# EAGLE design receiver (EAGLE 7.7.0)
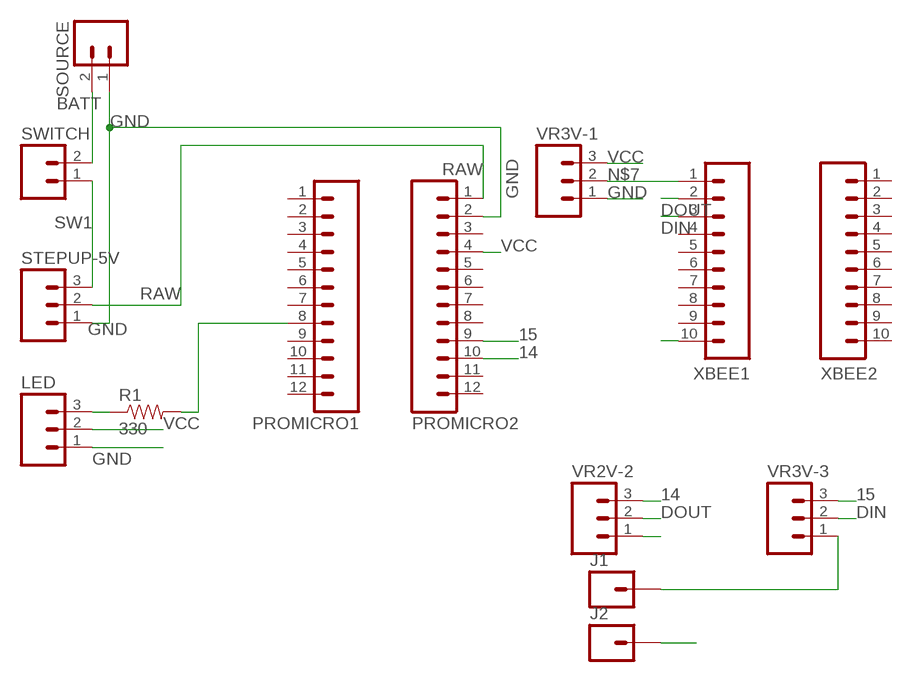
[diagram p0: schematic, sheet 1]

## Parts
J1  M01PTH  [1X01]
J2  M01PTH  [1X01]
LED  M03LOCK  [1X03_LOCK]
PROMICRO1  M12LOCK  [1X12_LOCK]
PROMICRO2  M12LOCK  [1X12_LOCK]
R1  330  RESISTORPTH-1/4W  [AXIAL-0.4]
SOURCE  M02JST-PTH-VERT  [JST-2-PTH-VERT]
STEPUP-5V  M03LOCK  [1X03_LOCK]
SWITCH  M02LOCK  [1X02_LOCK]
VR2V-2  M03LOCK  [1X03_LOCK]
VR3V-1  M03LOCK  [1X03_LOCK]
VR3V-3  M03LOCK  [1X03_LOCK]
XBEE1  M10LOCK  [1X10_LOCK]
XBEE2  M10LOCK  [1X10_LOCK]

## Nets
14: PROMICRO2.10 VR2V-2.3
15: PROMICRO2.9 VR3V-3.3
BATT: SOURCE.2 SWITCH.2
DIN: VR3V-3.2 XBEE1.3
DOUT: VR2V-2.2 XBEE1.2
GND: J1.1 J2.1 LED.1 PROMICRO2.2 SOURCE.1 STEPUP-5V.1 VR2V-2.1 VR3V-1.1 VR3V-3.1
N$1: LED.3 R1.P$1
N$2: PROMICRO1.8 R1.P$2
N$3: XBEE1.10
N$7: VR3V-1.2 XBEE1.1
RAW: PROMICRO2.1 STEPUP-5V.2
SW1: STEPUP-5V.3 SWITCH.1
VCC: LED.2 PROMICRO2.4 VR3V-1.3
Unconnected: PROMICRO1.1 PROMICRO1.2 PROMICRO1.3 PROMICRO1.4 PROMICRO1.5 PROMICRO1.6 PROMICRO1.7 PROMICRO1.9 PROMICRO1.10 PROMICRO1.11 PROMICRO1.12 PROMICRO2.3 PROMICRO2.5 PROMICRO2.6 PROMICRO2.7 PROMICRO2.8 PROMICRO2.11 PROMICRO2.12 XBEE1.4 XBEE1.5 XBEE1.6 XBEE1.7 XBEE1.8 XBEE1.9 XBEE2.1 XBEE2.2 XBEE2.3 XBEE2.4 XBEE2.5 XBEE2.6 XBEE2.7 XBEE2.8 XBEE2.9 XBEE2.10

## Library data of the parts
J1 J2 = SparkFun-Connectors:M01: Header 1 Standard 1-pin 0.1" header. Use with straight break away headers (SKU : PRT-00116), right angle break away headers (PRT-00553), swiss pins (PRT-00743), machine pins (PRT-00117), and female headers (PRT-00115). SMTSO-256-ET is a "flush mount" nut for a 4-40 screw. The older package used to be too tight, and did not allow it to sit properly thru the drill hit. The latest (0.165DIA) fits nice and snug.
LED STEPUP-5V VR2V-2 VR3V-1 VR3V-3 = SparkFun-Connectors:M03: Header 3 Standard 3-pin 0.1" header. Use with straight break away headers (SKU : PRT-00116), right angle break away headers (PRT-00553), swiss pins (PRT-00743), machine pins (PRT-00117), and female headers (PRT-00115). Molex polarized connector foot print use with SKU : PRT-08232 with associated crimp pins and housings.
PROMICRO1 PROMICRO2 = SparkFun-Connectors:M12: Header 12 Standard 12-pin 0.1" header. Use with straight break away headers (SKU : PRT-00116), right angle break away headers (PRT-00553), swiss pins (PRT-00743), machine pins (PRT-00117), and female headers (PRT-00115).
R1 = SparkFun-Passives:RESISTOR: Resistor Basic schematic elements and footprints for 0603, 1206, and PTH resistors.
SOURCE SWITCH = SparkFun-Connectors:M02: Standard 2-pin 0.1" header. Use with - straight break away headers ( PRT-00116) - right angle break away headers (PRT-00553) - swiss pins (PRT-00743) - machine pins (PRT-00117) - female headers (PRT-00115) Molex polarized connector foot print use with: PRT-08233 with associated crimp pins and housings. 2.54_SCREWTERM for use with PRT-10571. 3.5mm Screw Terminal footprints for PRT-08084 5mm Screw Terminal footprints for use with PRT-08432
XBEE1 XBEE2 = SparkFun-Connectors:M10: Header 10 Standard 10-pin 0.1" header. Use with straight break away headers (SKU : PRT-00116), right angle break away headers (PRT-00553), swiss pins (PRT-00743), machine pins (PRT-00117), and female headers (PRT-00115).

## Board
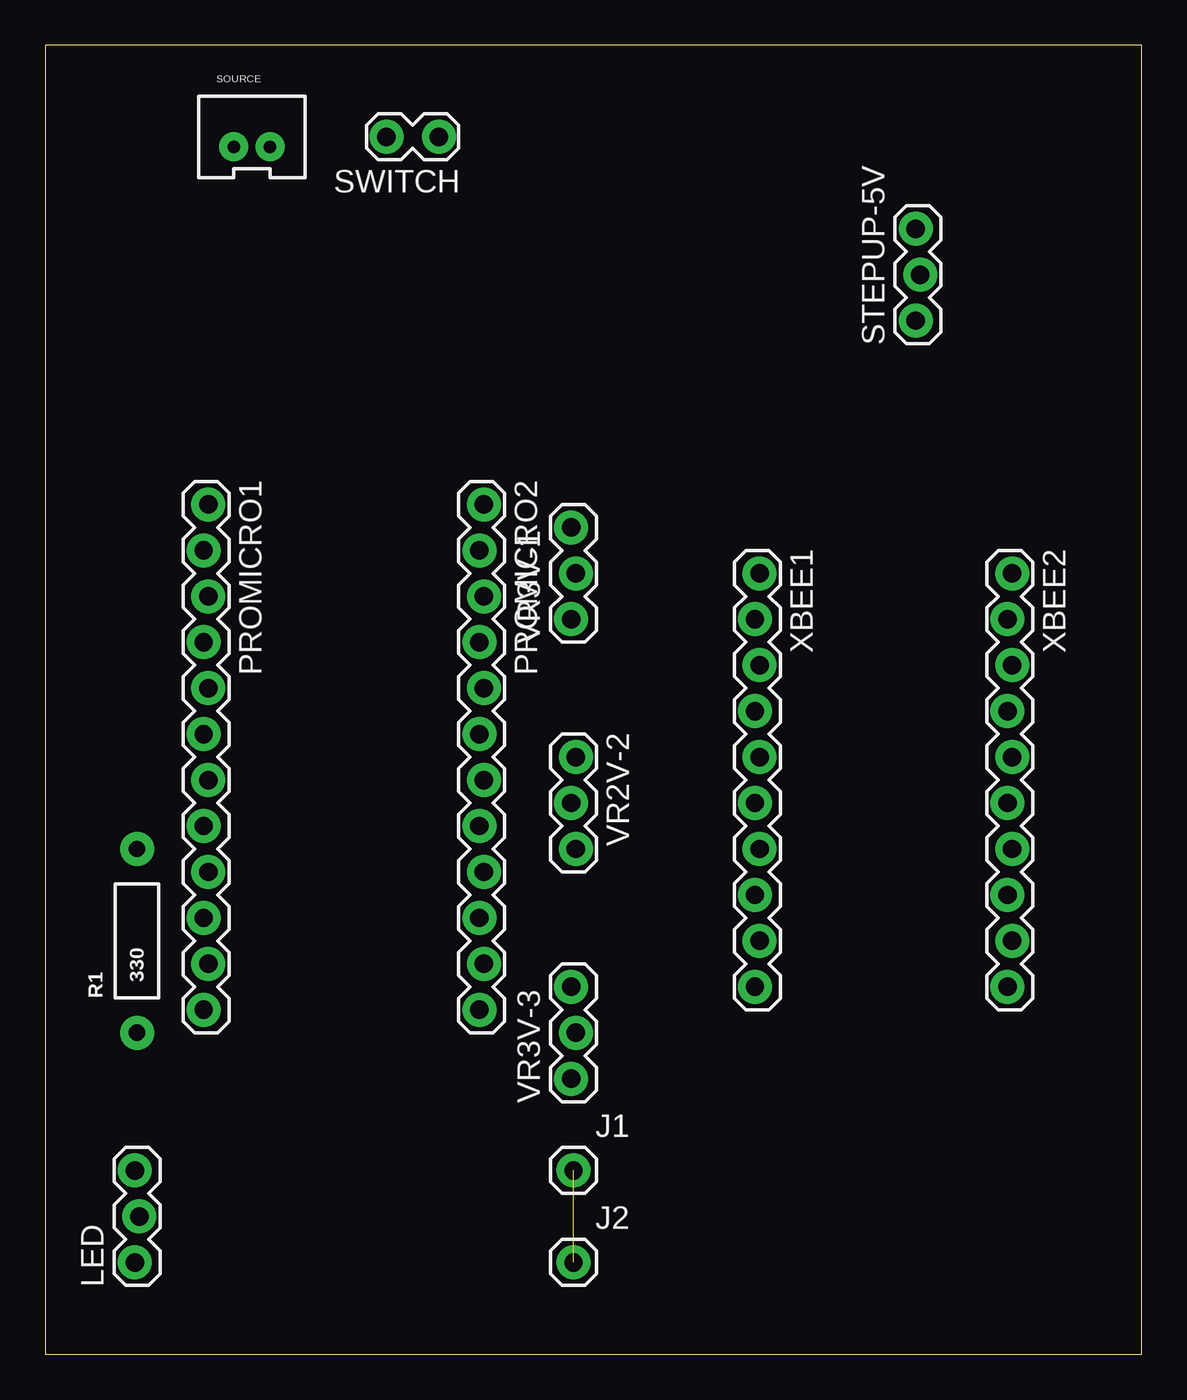
[diagram p1: board, top side]
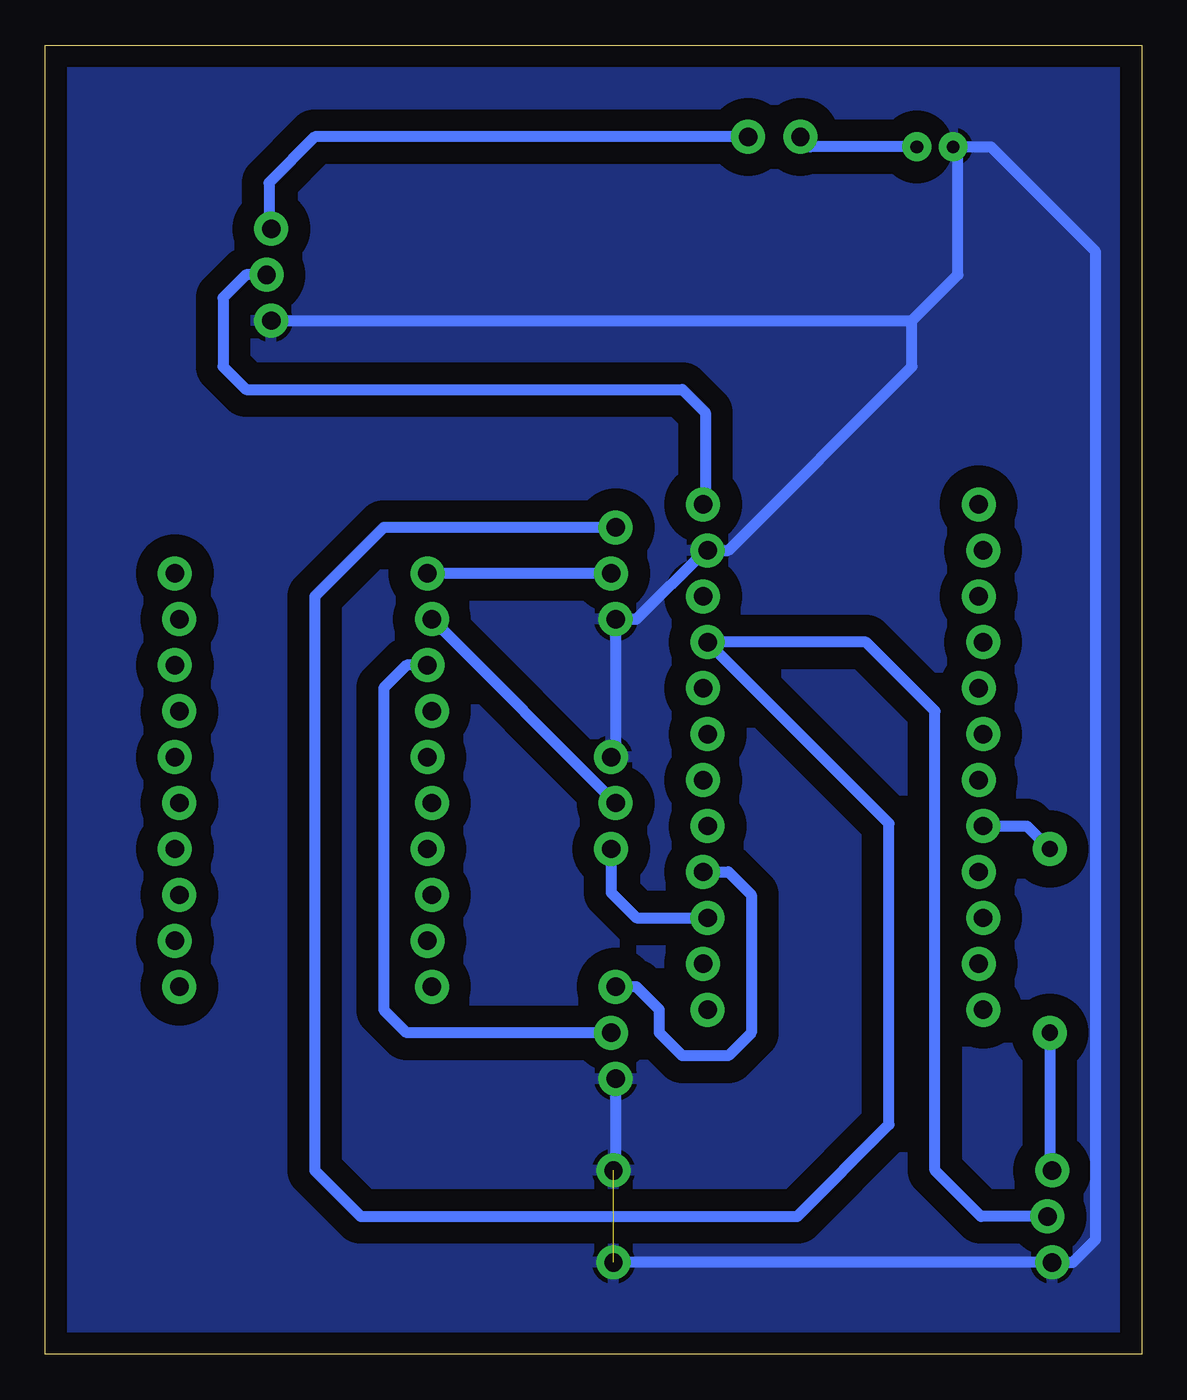
[diagram p2: board, bottom side, seen from below]

Size 60.63 x 72.38 mm. Coordinates in mm from the lower left corner, seen from the top.
Outline: 0,0 60.63,0 60.63,72.38 0,72.38 0,0
Copper layers (1*16): Top 0.035mm / dielectric 1.5mm / Bottom 0.035mm
Design rules "default": minimum track width 10mil, minimum drill 24mil, track to track 8mil, track to pad 8mil, pad to pad 8mil, via to via 8mil, smd to smd 8mil, copper to edge 40mil, drill to drill 8mil, minimum pad ring 10mil, minimum via ring 8mil, stop-mask expansion 4mil, vias tented up to drill 0mil, thermal gap 10mil

### Footprints (pad centres in the part's own frame; a part is rotated, then mirrored left to right if it is on the bottom)
1X01 = drill 1.016 pad 1.88: 1 0,0
1X03_LOCK = drill 1.016 pad 1.88: 1 0,0.127; 2 2.54,-0.127; 3 5.08,0.127
1X12_LOCK = drill 1.016 pad 1.88: 1 0,0.127; 2 2.54,-0.127; 3 5.08,0.127; 4 7.62,-0.127; 5 10.16,0.127; 6 12.7,-0.127; 7 15.24,0.127; 8 17.78,-0.127; 9 20.32,0.127; 10 22.86,-0.127; 11 25.4,0.127; 12 27.94,-0.127
AXIAL-0.4 = drill 0.9 pad 1.88: P$1 -5.08,0; P$2 5.08,0
JST-2-PTH-VERT = drill 0.7 pad 1.6: 1 -1,-0.55; 2 1,-0.55
1X02_LOCK = drill 1.016 pad 1.88: 1 -0.178,0; 2 2.718,0
1X10_LOCK = drill 1.016 pad 1.88: 1 0,0.127; 2 2.54,-0.127; 3 5.08,0.127; 4 7.62,-0.127; 5 10.16,0.127; 6 12.7,-0.127; 7 15.24,0.127; 8 17.78,-0.127; 9 20.32,0.127; 10 22.86,-0.127

### Placement (x,y rotation side)
J1  29.21,10.16 0 top
J2  29.21,5.08 0 top
LED  5.08,5.08 90 top
PROMICRO1  8.89,46.99 270 top
PROMICRO2  24.13,46.99 270 top
R1  5.08,22.86 90 top
SOURCE  11.43,67.31 0 top
STEPUP-5V  48.26,57.15 90 top
SWITCH  21.59,67.31 180 top
VR2V-2  29.21,33.02 270 top
VR3V-1  29.21,40.64 90 top
VR3V-3  29.21,15.24 90 top
XBEE1  39.37,43.18 270 top
XBEE2  53.34,43.18 270 top

### Tracks (layer width: path | path; a pad name or v marks a point on that pad's centre or on a via)
14
  Bottom 0.61: VR2V-2.3 29.34,25.53 27.94,24.13 PROMICRO2.10
15
  Bottom 0.61: PROMICRO2.9 22.86,26.67 21.59,25.4 21.59,17.78 22.86,16.51 25.4,16.51 26.67,17.78 26.67,19.05 27.94,20.32 VR3V-3.3
BATT
  Bottom 0.61: SOURCE.2 18.32,66.76 SWITCH.2
DIN
  Bottom 0.61: XBEE1.3 40.64,38.1 41.91,36.83 41.91,19.05 40.64,17.78 VR3V-3.2
DOUT
  Bottom 0.61: XBEE1.2 VR2V-2.2
GND  (1 unrouted)
  Bottom 0.61: J2.1 LED.1 3.81,5.08 2.54,6.35 2.54,60.96 8.34,66.76 SOURCE.1 10.16,66.49 10.16,59.69 12.7,57.15 | VR2V-2.1 29.08,33.27 VR3V-1.1 27.94,40.64 24.13,44.45 PROMICRO2.2 22.86,44.45 12.7,54.61 12.7,57.15 | STEPUP-5V.1 12.7,57.15 | VR3V-3.1 29.08,10.29 J1.1
  pour Bottom (isolate 1.2): 0,72.39 60.96,72.39 60.96,0 0,0
N$1
  Bottom 0.61: R1.P$1 5.08,10.29 LED.3
N$2
  Bottom 0.61: PROMICRO1.8 6.35,29.21 R1.P$2
N$7
  Bottom 0.61: VR3V-1.2 XBEE1.1
RAW
  Bottom 0.61: STEPUP-5V.2 49.53,59.69 50.8,58.42 50.8,54.61 49.53,53.34 25.4,53.34 24.13,52.07 24.13,47.12 PROMICRO2.1
SW1
  Bottom 0.61: SWITCH.1 45.72,67.31 48.26,64.77 48.26,62.36 STEPUP-5V.3
VCC
  Bottom 0.61: LED.2 8.89,7.62 11.43,10.16 11.43,35.56 15.24,39.37 PROMICRO2.4 13.97,29.34 13.97,12.7 19.05,7.62 43.18,7.62 45.72,10.16 45.72,41.91 41.91,45.72 VR3V-1.3